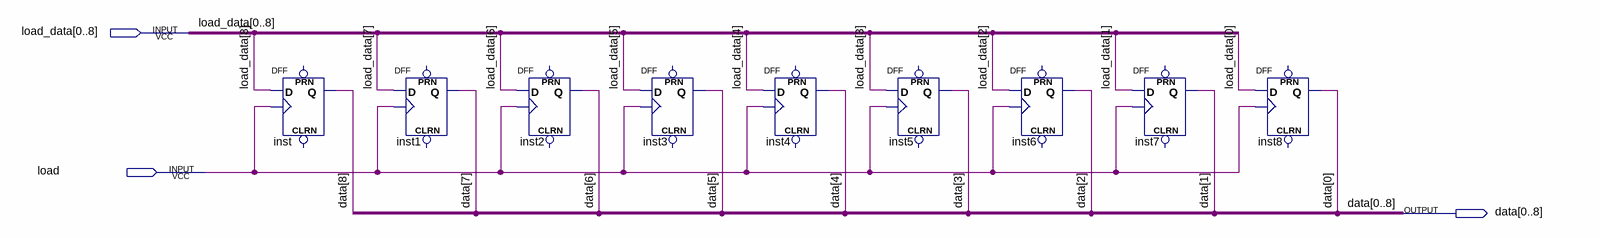
[diagram p0: schematic sheet]
// Quartus schematic np_register.bdf as structural Verilog: 9 symbols, 3 pins
module np_register (
  input  [0:8] load_data,
  input  load,
  output [0:8] data
);

  DFF inst (.CLK(load), .D(load_data[8]), .Q(data[8]));  // open: CLRN, PRN
  DFF inst1 (.CLK(load), .D(load_data[7]), .Q(data[7]));  // open: CLRN, PRN
  DFF inst2 (.CLK(load), .D(load_data[6]), .Q(data[6]));  // open: CLRN, PRN
  DFF inst3 (.CLK(load), .D(load_data[5]), .Q(data[5]));  // open: CLRN, PRN
  DFF inst4 (.CLK(load), .D(load_data[4]), .Q(data[4]));  // open: CLRN, PRN
  DFF inst5 (.CLK(load), .D(load_data[3]), .Q(data[3]));  // open: CLRN, PRN
  DFF inst6 (.CLK(load), .D(load_data[2]), .Q(data[2]));  // open: CLRN, PRN
  DFF inst7 (.CLK(load), .D(load_data[1]), .Q(data[1]));  // open: CLRN, PRN
  DFF inst8 (.CLK(load), .D(load_data[0]), .Q(data[0]));  // open: CLRN, PRN
endmodule
